# Altium project Gimbal_Rev2.PrjPcb (part 1 of 2)
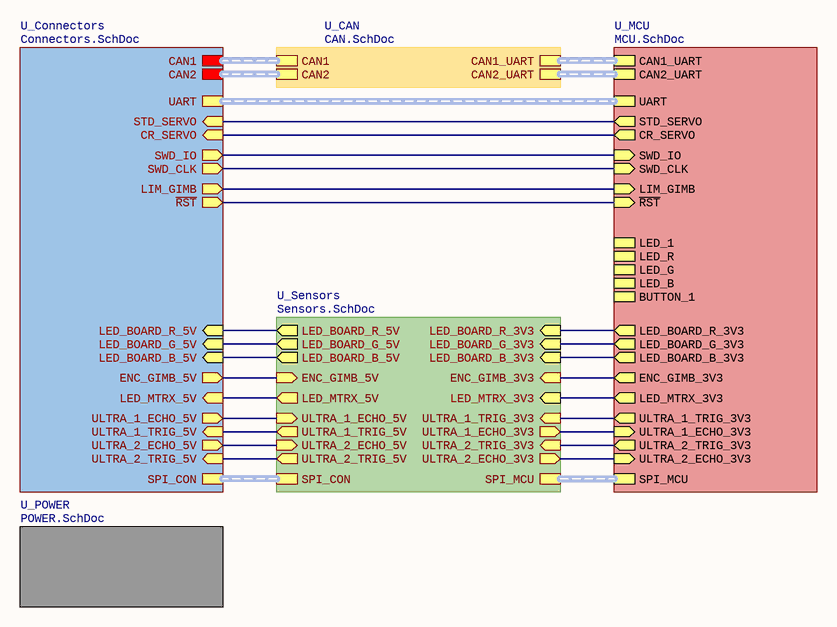
[diagram p0: Block Diagram.SchDoc]
6 sheets, 110 parts. Net scope: hierarchical (ports join the sheet entries above them; power ports are global).
Sheets:
  Block Diagram.SchDoc
    U_Connectors = Connectors.SchDoc
    U_MCU = MCU.SchDoc
    U_POWER = POWER.SchDoc
    U_Sensors = Sensors.SchDoc
    U_CAN = CAN.SchDoc

## Sheet Block Diagram.SchDoc: Gimbal - Block Diagram
size Letter; DrawnBy: Aidan Gratton; Organization: UW Robotics; Address1: 200 University Avenue; Address2: Waterloo; Address3: Ontario; Address4: Canada N2L 3G6; SheetNumber: 1

### Sub-sheets
U_CAN = CAN.SchDoc: CAN1 (harness CAN1), CAN2 (harness CAN2), CAN2_UART (harness CAN2_UART), CAN1_UART (harness CAN1_UART)
U_Connectors = Connectors.SchDoc: ~{RST} (out), LIM_GIMB (out), LED_MTRX_5V (in), CAN1 (harness CAN1), CAN2 (harness CAN2), UART (harness UART), SPI_CON (harness SPI_CON), ENC_GIMB_5V (out), ULTRA_1_ECHO_5V (out), ULTRA_1_TRIG_5V (in), ULTRA_2_ECHO_5V (out), ULTRA_2_TRIG_5V (in), STD_SERVO (in), CR_SERVO (in), SWD_IO (out), SWD_CLK (out), LED_BOARD_R_5V (in), LED_BOARD_G_5V (in), LED_BOARD_B_5V (in)
U_MCU = MCU.SchDoc: ~{RST} (in), ENC_GIMB_3V3 (out), LIM_GIMB (in), UART (harness UART), CAN1_UART (harness CAN1_UART), CAN2_UART (harness CAN2_UART), SPI_MCU (harness SPI), LED_MTRX_3V3 (out), ULTRA_1_TRIG_3V3 (out), ULTRA_1_ECHO_3V3 (in), ULTRA_2_TRIG_3V3 (out), ULTRA_2_ECHO_3V3 (in), LED_1, LED_R, LED_G, LED_B, BUTTON_1, STD_SERVO (out), CR_SERVO (out), SWD_IO (in), SWD_CLK (in), LED_BOARD_R_3V3 (out), LED_BOARD_G_3V3 (out), LED_BOARD_B_3V3 (out)
U_POWER = POWER.SchDoc: no entries
U_Sensors = Sensors.SchDoc: ENC_GIMB_3V3 (in), SPI_MCU (harness SPI), SPI_CON (harness SPI_CON), ENC_GIMB_5V (in), ULTRA_1_TRIG_3V3 (in), ULTRA_1_ECHO_3V3 (out), ULTRA_2_TRIG_3V3 (in), ULTRA_2_ECHO_3V3 (out), ULTRA_1_ECHO_5V (in), ULTRA_1_TRIG_5V (out), ULTRA_2_ECHO_5V (in), ULTRA_2_TRIG_5V (out), LED_MTRX_5V (out), LED_MTRX_3V3 (in), LED_BOARD_R_3V3 (in), LED_BOARD_G_3V3 (in), LED_BOARD_B_3V3 (in), LED_BOARD_B_5V (out), LED_BOARD_G_5V (out), LED_BOARD_R_5V (out)

### Nets
NetCR_SERVO_1: sheet U_Connectors/CR_SERVO, sheet U_MCU/CR_SERVO
NetECHO1_1: sheet U_MCU/ULTRA_1_ECHO_3V3, sheet U_Sensors/ULTRA_1_ECHO_3V3
NetECHO2_1: sheet U_MCU/ULTRA_2_ECHO_3V3, sheet U_Sensors/ULTRA_2_ECHO_3V3
NetENC1_1: sheet U_MCU/ENC_GIMB_3V3, sheet U_Sensors/ENC_GIMB_3V3
NetJ1_6: sheet U_Connectors/SWD_IO, sheet U_MCU/SWD_IO
NetJ1_7: sheet U_Connectors/SWD_CLK, sheet U_MCU/SWD_CLK
NetJ1_8: sheet U_Connectors/~{RST}, sheet U_MCU/~{RST}
NetJ3_1: sheet U_Connectors/STD_SERVO, sheet U_MCU/STD_SERVO
NetJ4_3: sheet U_Connectors/ULTRA_1_ECHO_5V, sheet U_Sensors/ULTRA_1_ECHO_5V
NetJ4_5: sheet U_Connectors/LED_MTRX_5V, sheet U_Connectors/ULTRA_1_TRIG_5V, sheet U_Connectors/ULTRA_2_TRIG_5V, sheet U_Sensors/ULTRA_1_TRIG_5V, sheet U_Sensors/ULTRA_2_TRIG_5V, sheet U_Sensors/LED_MTRX_5V
NetJ4_9: sheet U_Connectors/ULTRA_2_ECHO_5V, sheet U_Sensors/ULTRA_2_ECHO_5V
NetJ4_10: sheet U_Connectors/LIM_GIMB, sheet U_MCU/LIM_GIMB
NetJ4_23: sheet U_Connectors/ENC_GIMB_5V, sheet U_Sensors/ENC_GIMB_5V
NetLED_BOARD_B_1: sheet U_Connectors/LED_BOARD_B_5V, sheet U_Sensors/LED_BOARD_B_5V
NetLED_BOARD_G_1: sheet U_Connectors/LED_BOARD_G_5V, sheet U_Sensors/LED_BOARD_G_5V
NetLED_BOARD_R_1: sheet U_Connectors/LED_BOARD_R_5V, sheet U_Sensors/LED_BOARD_R_5V
NetU3_2: sheet U_MCU/ULTRA_1_TRIG_3V3, sheet U_Sensors/ULTRA_1_TRIG_3V3
NetU3_3: sheet U_MCU/ULTRA_2_TRIG_3V3, sheet U_Sensors/ULTRA_2_TRIG_3V3
NetU3_4: sheet U_MCU/LED_MTRX_3V3, sheet U_Sensors/LED_MTRX_3V3
NetU5_2: sheet U_MCU/LED_BOARD_R_3V3, sheet U_Sensors/LED_BOARD_R_3V3
NetU5_3: sheet U_MCU/LED_BOARD_G_3V3, sheet U_Sensors/LED_BOARD_G_3V3
NetU5_4: sheet U_MCU/LED_BOARD_B_3V3, sheet U_Sensors/LED_BOARD_B_3V3

### Buses and harness runs
harness sheet U_CAN/CAN1 = sheet U_Connectors/CAN1
harness sheet U_CAN/CAN1_UART = sheet U_MCU/CAN1_UART
harness sheet U_CAN/CAN2 = sheet U_Connectors/CAN2
harness sheet U_CAN/CAN2_UART = sheet U_MCU/CAN2_UART
harness sheet U_Connectors/SPI_CON = sheet U_Sensors/SPI_CON
harness sheet U_Connectors/UART = sheet U_MCU/UART
harness sheet U_MCU/SPI_MCU = sheet U_Sensors/SPI_MCU

### Notes on the sheet
- Title
- Size:
- Date:
- Letter
- Drawn By:
- Sheet
- of
- File:

## Sheet Connectors.SchDoc: Gimbal - Connectors
size Letter; DrawnBy: Aidan Gratton; Organization: UW Robotics; Address1: 200 University Avenue; Address2: Waterloo; Address3: Ontario; Address4: Canada N2L 3G6; SheetNumber: 3; SheetTotal: 7
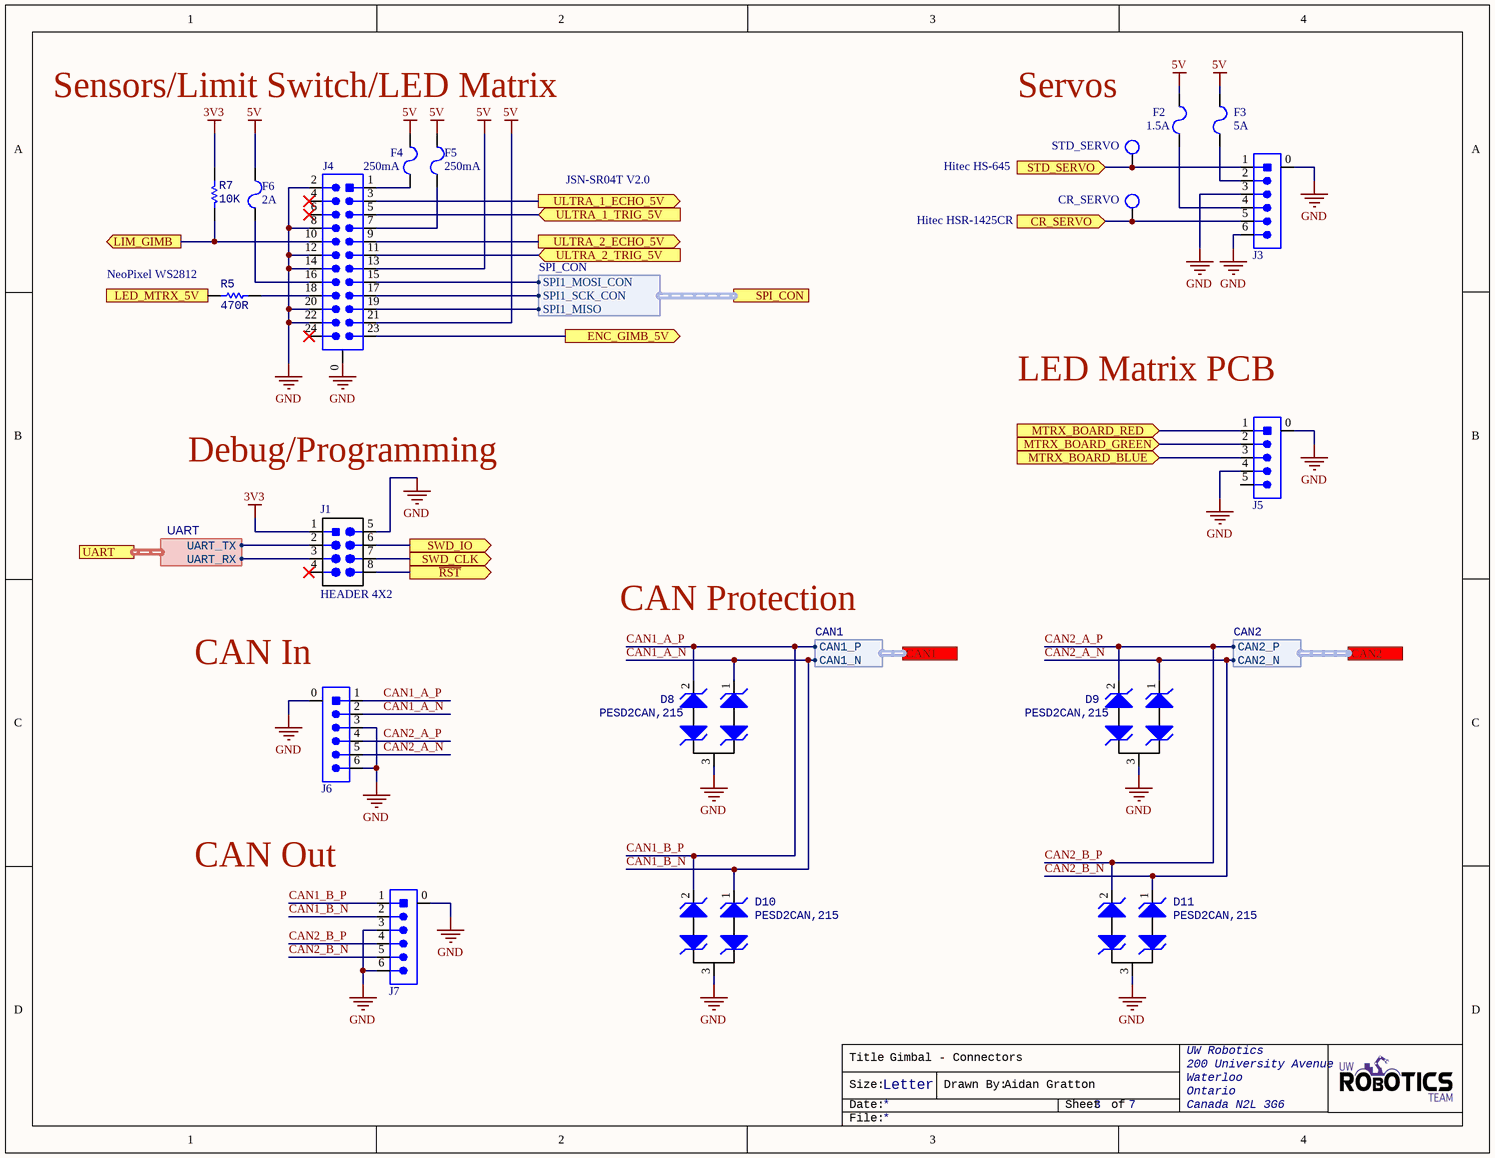
[diagram p1: Connectors.SchDoc]

### Parts
CR_SERVO  TESTPOINT_LOOP  [TESTPOINT_LOOP]  (value not drawn)
D8  Manufacturer Part Number: PESD2CAN,215  [TVS_DIODE_CAN]  (hidden comment: TVS_DIODE_CAN)
D9  Manufacturer Part Number: PESD2CAN,215  [TVS_DIODE_CAN]  (hidden comment: TVS_DIODE_CAN)
D10  Manufacturer Part Number: PESD2CAN,215  [TVS_DIODE_CAN]  (hidden comment: TVS_DIODE_CAN)
D11  Manufacturer Part Number: PESD2CAN,215  [TVS_DIODE_CAN]  (hidden comment: TVS_DIODE_CAN)
F2  Current Rating: 1.5A  [FUSE_1206]  (hidden comment: FUSE_1.5A_1206)
F3  Current Rating: 5A  [FUSE_1206]  (hidden comment: FUSE_5A_1206)
F4  Current Rating: 250mA  [FUSE_1206]  (hidden comment: FUSE_250mA_1206)
F5  Current Rating: 250mA  [FUSE_1206]  (hidden comment: FUSE_250mA_1206)
F6  Current Rating: 2A  [FUSE_1206]  (hidden comment: FUSE_2A_1206)
J1  HEADER 4X2  [HEADER_2X4]
J3  CON_6M_SM_RA  [MOLEX-5024940670]  (value not drawn)
J4  CON_12x2M_SM_RA  [MOLEX-5031482490]  (value not drawn)
J5  CON_5M_SM_RA  [MOLEX-5025850570]  (value not drawn)
J6  CON_6M_SM_RA  [MOLEX-5024940670]  (value not drawn)
J7  CON_6M_SM_RA  [MOLEX-5024940670]  (value not drawn)
R5  value 470R  [RESC0603(1608)_N]  (hidden comment: 470R 1%)
R7  value 10K  [RESC0603(1608)_N]  (hidden comment: RES_10K_0603)
STD_SERVO  TESTPOINT_LOOP  [TESTPOINT_LOOP]  (value not drawn)

### Ports
CAN1 (harness CAN1), CAN2 (harness CAN2), CR_SERVO (in), ENC_GIMB_5V (out), LED_MTRX_5V (in), LIM_GIMB (out), MTRX_BOARD_BLUE (in), MTRX_BOARD_GREEN (in), MTRX_BOARD_RED (in), SPI_CON (harness SPI_CON), STD_SERVO (in), SWD_CLK (out), SWD_IO (out), UART (harness UART), ULTRA_1_ECHO_5V (out), ULTRA_1_TRIG_5V (in), ULTRA_2_ECHO_5V (out), ULTRA_2_TRIG_5V (in), ~{RST} (out)

### Harnesses
UART: UART_RX, UART_TX
CAN2: CAN2_P, CAN2_N
CAN1: CAN1_P, CAN1_N
SPI_CON: SPI1_MISO, SPI1_MOSI_CON, SPI1_SCK_CON

### Nets
3V3: J1.1(VCC) R7.2
5V: F2.2 F3.2 F4.1 F5.2 F6.2 J4.13 J4.21
GND: D8.3 D9.3 D10.3 D11.3 J1.5(GND) J3.0 J3.3 J3.6 J4.0 J4.2 J4.8 J4.12 J4.14 J4.20 J4.22 J5.0 J5.4 J6.0 J6.3 J6.6 J7.0 J7.3 J7.6
CAN1_A_N: D8.1 D10.1 J6.2 J7.2 ; port CAN1.CAN1_N  [also labelled CAN1_B_N]
CAN1_A_P: D8.2 D10.2 J6.1 J7.1 ; port CAN1.CAN1_P  [also labelled CAN1_B_P]
CAN2_A_N: D9.1 D11.1 J6.5 J7.5 ; port CAN2.CAN2_N  [also labelled CAN2_B_N]
CAN2_A_P: D9.2 D11.2 J6.4 J7.4 ; port CAN2.CAN2_P  [also labelled CAN2_B_P]
NetCR_SERVO_1: CR_SERVO.1 J3.5 ; port CR_SERVO
NetF2_1: F2.1 J3.4
NetF3_1: F3.1 J3.2
NetF4_2: F4.2 J4.1
NetF5_1: F5.1 J4.7
NetF6_1: F6.1 J4.16
NetJ1_2: J1.2 ; port UART.UART_TX
NetJ1_3: J1.3 ; port UART.UART_RX
NetJ1_6: J1.6 ; port SWD_IO
NetJ1_7: J1.7 ; port SWD_CLK
NetJ1_8: J1.8 ; port ~{RST}
NetJ3_1: J3.1 STD_SERVO.1 ; port STD_SERVO
NetJ4_3: J4.3 ; port ULTRA_1_ECHO_5V
NetJ4_5: J4.5 J4.11 R5.1 ; port LED_MTRX_5V, port ULTRA_1_TRIG_5V, port ULTRA_2_TRIG_5V
NetJ4_9: J4.9 ; port ULTRA_2_ECHO_5V
NetJ4_10: J4.10 R7.1 ; port LIM_GIMB
NetJ4_15: J4.15 ; port SPI_CON.SPI1_MOSI_CON
NetJ4_17: J4.17 ; port SPI_CON.SPI1_SCK_CON
NetJ4_18: J4.18 R5.2
NetJ4_19: J4.19 ; port SPI_CON.SPI1_MISO
NetJ4_23: J4.23 ; port ENC_GIMB_5V
NetJ5_1: J5.1 ; port MTRX_BOARD_RED
NetJ5_2: J5.2 ; port MTRX_BOARD_GREEN
NetJ5_3: J5.3 ; port MTRX_BOARD_BLUE

Not connected (* = marked no-connect by the designer): J1 4*; J4 4* 6* 24*; J5 5

### Notes on the sheet
- Sensors/Limit Switch/LED Matrix
- Servos
- JSN-SR04T V2.0
- Hitec HSR-1425CR
- Hitec HS-645
- (near R5) NeoPixel WS2812
- (near J5) LED Matrix PCB
- Debug/Programming
- CAN Protection
- (near J6) CAN In
- CAN Out
- Title
- Size:
- Date:
- Letter
- Drawn By:
- Sheet
- of
- File:

### Library data of the parts
CR_SERVO STD_SERVO = TESTPOINT_LOOP: Loop testpoint through-hole pad; Manufacturer: Keystone Electronics; Manufacturer Part Number 1: 5002; Supplier Part Number 1: 36-5002-ND; Supplier 1: Digi-Key
D8-D11 = TVS_DIODE_CAN: TVS DIODE 24V 41V SOT323-3; Manufacturer: Nexperia USA Inc.; Package: SC-70, SOT-323; ComponentLink1Description: Datasheet; ComponentLink1URL: https://assets.nexperia.com/documents/data-sheet/PESD1CAN-U.pdf; Supplier Part Number 1: 1727-3891-1-ND; Supplier 1: Digi-Key
F2 = FUSE_1.5A_1206: FUSE SMD 1.5A 63V; Manufacturer 1: Littelfuse; Manufacturer Part Number 1: 046601.5NR; Fuse Type: Board Mount (Cartridge Style Excluded); DC Cold Resistance: 31mR; Power Dissipation: 157.5mW; Approvals: UL,CSA; Supplier 1: Digi-Key; Stock 1: 8989; Pricing 1: 1=0.84000, 5=0.81200, 10=0.78700, 50=0.66180, 100=0.54930, 250=0.49940, 500=0.42450, 1000=0.37455 (USD); RoHS: Yes; Mount: Surface Mount; Case/Package: 1206; Case Code (Imperial): 1206; Case Code (Metric): 3216; Housing Material: Ceramic; Min Operating Temperature: -55°C; Max Operating Temperature: 90°C; Package Quantity: 5000; Voltage Rating (AC): 63V; Voltage Rating (DC): 63V; Packaging: Tape and Reel; Current: 1.5A; Length: 3.18mm; Height: 0.023inch; Width: 0.06inch; Depth: 1.52mm; ComponentLink1URL: https://datasheet.ciiva.com/7444/littelfuse-fuse-466-7444359.pdf?src-supplier=Digi-Key; ComponentLink1Description: https://datasheet.ciiva.com/7444/littelfuse-fuse-466-7444359.pdf?src-supplier=Digi-Key; ComponentLink2URL: https://datasheet.ciiva.com/7444/littelfuse-fuse-466-7444363.pdf?src-supplier=Digi-Key; ComponentLink2Description: https://datasheet.ciiva.com/7444/littelfuse-fuse-466-7444363.pdf?src-supplier=Digi-Key; ComponentLink3URL: https://datasheet.ciiva.com/7444/littelfuse-fuse-466-7444350.pdf?src-supplier=Digi-Key; ComponentLink3Description: https://datasheet.ciiva.com/7444/littelfuse-fuse-466-7444350.pdf?src-supplier=Digi-Key; Supplier Part Number 1: F1462CT-ND
F3 = FUSE_5A_1206: FUSE SMD 5A 63V; Manufacturer 1: Littelfuse; Manufacturer Part Number 1: 0466005.NRHF; Voltage Rating (AC): 32V; Fuse Type: Board Mount (Cartridge Style Excluded); DC Cold Resistance: 31mR; Power Dissipation: 157.5mW; Approvals: UL,CSA; Supplier 1: Digi-Key; Stock 1: 8989; Pricing 1: 1=0.84000, 5=0.81200, 10=0.78700, 50=0.66180, 100=0.54930, 250=0.49940, 500=0.42450, 1000=0.37455 (USD); RoHS: Yes; Mount: Surface Mount; Case/Package: 1206; Case Code (Imperial): 1206; Case Code (Metric): 3216; Housing Material: Ceramic; Min Operating Temperature: -55°C; Max Operating Temperature: 90°C; Package Quantity: 5000; Voltage Rating (DC): 32V; Packaging: Tape and Reel; Current: 5A; Length: 3.18mm; Height: 0.023inch; Width: 0.06inch; Depth: 1.52mm; ComponentLink1URL: https://datasheet.ciiva.com/7444/littelfuse-fuse-466-7444359.pdf?src-supplier=Digi-Key; ComponentLink1Description: https://datasheet.ciiva.com/7444/littelfuse-fuse-466-7444359.pdf?src-supplier=Digi-Key; ComponentLink2URL: https://datasheet.ciiva.com/7444/littelfuse-fuse-466-7444363.pdf?src-supplier=Digi-Key; ComponentLink2Description: https://datasheet.ciiva.com/7444/littelfuse-fuse-466-7444363.pdf?src-supplier=Digi-Key; ComponentLink3URL: https://datasheet.ciiva.com/7444/littelfuse-fuse-466-7444350.pdf?src-supplier=Digi-Key; ComponentLink3Description: https://datasheet.ciiva.com/7444/littelfuse-fuse-466-7444350.pdf?src-supplier=Digi-Key; Supplier Part Number 1: F6019CT-ND
F4 F5 = FUSE_250mA_1206: FUSE SMD 250mA 125V; Manufacturer 1: Littelfuse; Manufacturer Part Number 1: 0466.250NR; Fuse Type: Board Mount (Cartridge Style Excluded); DC Cold Resistance: 31mR; Power Dissipation: 157.5mW; Approvals: UL,CSA; Supplier 1: Digi-Key; Stock 1: 8989; Pricing 1: 1=0.84000, 5=0.81200, 10=0.78700, 50=0.66180, 100=0.54930, 250=0.49940, 500=0.42450, 1000=0.37455 (USD); RoHS: Yes; Mount: Surface Mount; Case/Package: 1206; Case Code (Imperial): 1206; Case Code (Metric): 3216; Housing Material: Ceramic; Min Operating Temperature: -55°C; Max Operating Temperature: 90°C; Package Quantity: 5000; Voltage Rating (AC): 125V; Voltage Rating (DC): 125V; Packaging: Tape and Reel; Current: 250mA; Length: 3.18mm; Height: 0.023inch; Width: 0.06inch; Depth: 1.52mm; ComponentLink1URL: https://datasheet.ciiva.com/7444/littelfuse-fuse-466-7444359.pdf?src-supplier=Digi-Key; ComponentLink1Description: https://datasheet.ciiva.com/7444/littelfuse-fuse-466-7444359.pdf?src-supplier=Digi-Key; ComponentLink2URL: https://datasheet.ciiva.com/7444/littelfuse-fuse-466-7444363.pdf?src-supplier=Digi-Key; ComponentLink2Description: https://datasheet.ciiva.com/7444/littelfuse-fuse-466-7444363.pdf?src-supplier=Digi-Key; ComponentLink3URL: https://datasheet.ciiva.com/7444/littelfuse-fuse-466-7444350.pdf?src-supplier=Digi-Key; ComponentLink3Description: https://datasheet.ciiva.com/7444/littelfuse-fuse-466-7444350.pdf?src-supplier=Digi-Key; Supplier Part Number 1: F1452CT-ND
F6 = FUSE_2A_1206: FUSE SMD 2A 63V; Manufacturer 1: Littelfuse; Manufacturer Part Number 1: 0466002.NRHF; Fuse Type: Board Mount (Cartridge Style Excluded); DC Cold Resistance: 31mR; Power Dissipation: 157.5mW; Approvals: UL,CSA; Supplier 1: Digi-Key; Stock 1: 8989; Pricing 1: 1=0.84000, 5=0.81200, 10=0.78700, 50=0.66180, 100=0.54930, 250=0.49940, 500=0.42450, 1000=0.37455 (USD); RoHS: Yes; Mount: Surface Mount; Case/Package: 1206; Case Code (Imperial): 1206; Case Code (Metric): 3216; Housing Material: Ceramic; Min Operating Temperature: -55°C; Max Operating Temperature: 90°C; Package Quantity: 5000; Voltage Rating (AC): 63V; Voltage Rating (DC): 63V; Packaging: Tape and Reel; Current: 2A; Length: 3.18mm; Height: 0.023inch; Width: 0.06inch; Depth: 1.52mm; ComponentLink1URL: https://datasheet.ciiva.com/7444/littelfuse-fuse-466-7444359.pdf?src-supplier=Digi-Key; ComponentLink1Description: https://datasheet.ciiva.com/7444/littelfuse-fuse-466-7444359.pdf?src-supplier=Digi-Key; ComponentLink2URL: https://datasheet.ciiva.com/7444/littelfuse-fuse-466-7444363.pdf?src-supplier=Digi-Key; ComponentLink2Description: https://datasheet.ciiva.com/7444/littelfuse-fuse-466-7444363.pdf?src-supplier=Digi-Key; ComponentLink3URL: https://datasheet.ciiva.com/7444/littelfuse-fuse-466-7444350.pdf?src-supplier=Digi-Key; ComponentLink3Description: https://datasheet.ciiva.com/7444/littelfuse-fuse-466-7444350.pdf?src-supplier=Digi-Key; Supplier Part Number 1: F5696CT-ND
J1 = HEADER 4X2: CONN HEADER VERT 8POS 2.54MM; Manufacturer Part Number 1: M20-9980445; Manufacturer 1: Harwin Inc.; Supplier Part Number 1: 952-2122-ND; Supplier 1: Digi-Key; Mount: Through Hole
J3 J6 J7 = CON_6M_SM_RA: CONN HEADER SMD RIGHT ANGLE 2MM PITCH; Manufacturer 1: Molex; Manufacturer Part Number 1: 502494-0670; Insulation Resistance: 1GR; Current Rating: 3A; Voltage Rating: 250V; Connector Type: Receptacle,Forked; Number of Positions: 6; Gender: Receptacle; Glow Wire Compliant: Non-compliant; Supplier 1: Digi-Key; Stock 1: 7093; Pricing 1: 1=0.81000, 10=0.70800, 25=0.66680, 50=0.63880, 100=0.61110, 250=0.55552 (USD); RoHS: Yes; Mount: Surface Mount; Material: Polybutylene; Color: Natural; Housing Material: PBT; Housing Color: Natural; Contact Plating: Tin; Contact Material: Copper Alloy; Min Operating Temperature: -25°C; Max Operating Temperature: 85°C; Package Quantity: 950; Number of Rows: 1; Fastening Type: Latch; Packaging: Tape and Reel; Termination: Solder; Number of Contacts: 6; Orientation: Right Angle; Number of Circuits: 6; Contact Gender: Female; Max Voltage Rating (AC): 250V; Max Voltage Rating (DC): 250V; Length: 16mm; Pitch: 2mm; Depth: 6.85mm; Radiation Hardening: No; REACH SVHC: Unknown; Flammability Rating: UL94 V-0; ComponentLink1URL: https://datasheet.ciiva.com/755/5024940670-sd-755844.pdf?src-supplier=Digi-Key; ComponentLink1Description: https://datasheet.ciiva.com/755/5024940670-sd-755844.pdf?src-supplier=Digi-Key; ComponentLink2URL: https://datasheet.ciiva.com/24467/101355024940670-pcb-receptacles-24467588.pdf?src-supplier=Onlinecomponents.com; ComponentLink2Description: https://datasheet.ciiva.com/24467/101355024940670-pcb-receptacles-24467588.pdf?src-supplier=Onlinecomponents.com; ComponentLink3URL: https://datasheet.ciiva.com/16656/5024940670-pcb-receptacles-16656439.pdf?src-supplier=Avnet+Europe; ComponentLink3Description: https://datasheet.ciiva.com/16656/5024940670-pcb-receptacles-16656439.pdf?src-supplier=Avnet+Europe; ComponentLink4URL: https://datasheet.ciiva.com/7436/1630854-7436283.pdf?src-supplier=Newark; ComponentLink4Description: https://datasheet.ciiva.com/7436/1630854-7436283.pdf?src-supplier=Newark; ComponentLink5URL: https://datasheet.ciiva.com/5157/5024940670-pcb-receptacles-179322-5157180.pdf?src-supplier=Mouser; ComponentLink5Description: https://datasheet.ciiva.com/5157/5024940670-pcb-receptacles-179322-5157180.pdf?src-supplier=Mouser; ComponentLink6URL: https://datasheet.ciiva.com/7917/1630854-7917014.pdf?src-supplier=Element14; ComponentLink6Description: https://datasheet.ciiva.com/7917/1630854-7917014.pdf?src-supplier=Element14; ComponentLink7URL: https://datasheet.ciiva.com/30242/101355024940670-pcb-receptacles-30242550.pdf?src-supplier=Onlinecomponents.com; ComponentLink7Description: https://datasheet.ciiva.com/30242/101355024940670-pcb-receptacles-30242550.pdf?src-supplier=Onlinecomponents.com; ComponentLink8URL: https://datasheet.ciiva.com/755/5024940670-sd-755789.pdf?src-supplier=Digi-Key; ComponentLink8Description: https://datasheet.ciiva.com/755/5024940670-sd-755789.pdf?src-supplier=Digi-Key; Supplier Part Number 1: WM2283CT-ND
J4 = CON_12x2M_SM_RA: CONN HEADER SMD RIGHT ANGLE 1.5MM PITCH
J5 = CON_5M_SM_RA: CONN HEADER SMD RIGHT ANGLE 1.5MM PITCH; Manufacturer 1: Molex; Manufacturer Part Number 1: 5025850570; Connector Type: Receptacle,Center Strip Contact; Number of Positions: 5; Current Rating: 2A; Supplier 1: Digi-Key; Stock 1: 2875; RoHS: Yes; Mount: Surface Mount; Termination: Solder; Number of Contacts: 5; Orientation: Right Angle; Number of Circuits: 5; Number of Rows: 1; Supplier Part Number 1: WM14469CT-ND
R5 = RES_470R_0603: RES SMD 470 OHM 1% 1/10W 0603; Manufacturer: Yageo; MPN: AC0603FR-07470RL; Package: 0603 (1608 Metric); Dimensions: 0.063" L x 0.031" W (1.60mm x 0.80mm); Tolerance: 1%; Supplier Part Number 1: 311-470LDCT-ND; Supplier 1: Digi-Key
R7 = RES_10K_0603: RES SMD 10K OHM 5% 1/10W 0603; Manufacturer: Yageo; MPN: RC0603JR-0710KL; Package: 0603 (1608 Metric); Dimensions: 0.063" L x 0.031" W (1.60mm x 0.80mm); Tolerance: 5%; Supplier Part Number 1: 311-10KGRCT-ND; Supplier 1: Digi-Key

## Sheet MCU.SchDoc: Gimbal - Microcontroller
size Letter; DrawnBy: Aidan Gratton; Organization: UW Robotics; Address1: 200 University Avenue; Address2: Waterloo; Address3: Ontario; Address4: Canada N2L 3G6; SheetNumber: 4; SheetTotal: 7
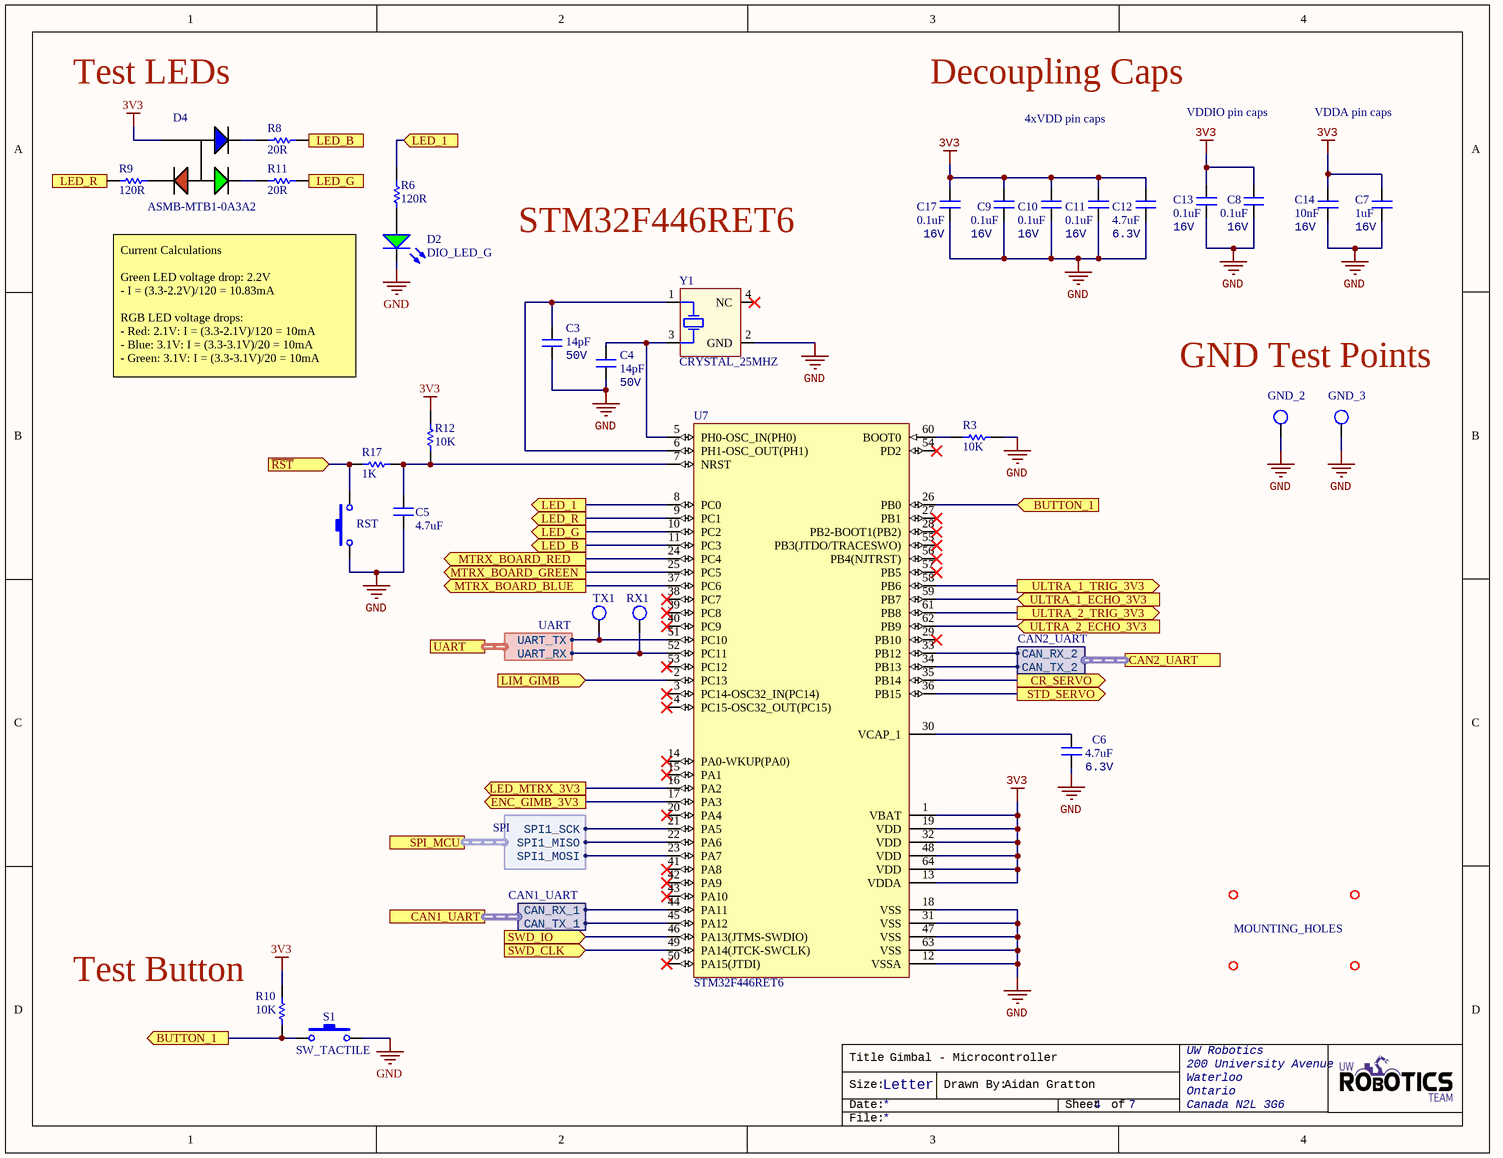
[diagram p2: MCU.SchDoc]

### Parts
C3  value 14pF  Voltage Rating (DC): 50V  [CAPC0603(1608)55_N]  (hidden comment: CL10C140JB8NNNC)
C4  value 14pF  Voltage Rating (DC): 50V  [CAPC0603(1608)55_N]  (hidden comment: CL10C140JB8NNNC)
C5  value 4.7uF  [CAPC0603(1608)55_N]  (hidden comment: CAP_4.7uF_0603)
C6  value 4.7uF  Voltage Rating: 6.3V  [CAPC0603(1608)55_N]  (hidden comment: CAP_4.7uF_0603)
C7  value 1uF  Voltage Rating: 16V  [CAPC0603(1608)55_N]  (hidden comment: CAP_1uF_16V_0603)
C8  value 0.1uF  Voltage Rating: 16V  [CAPC0603(1608)55_N]  (hidden comment: CAP_0.1uF_16V_0603)
C9  value 0.1uF  Voltage Rating: 16V  [CAPC0603(1608)55_N]  (hidden comment: CAP_0.1uF_16V_0603)
C10  value 0.1uF  Voltage Rating: 16V  [CAPC0603(1608)55_N]  (hidden comment: CAP_0.1uF_16V_0603)
C11  value 0.1uF  Voltage Rating: 16V  [CAPC0603(1608)55_N]  (hidden comment: CAP_0.1uF_16V_0603)
C12  value 4.7uF  Voltage Rating: 6.3V  [CAPC0603(1608)55_N]  (hidden comment: CAP_4.7uF_0603)
C13  value 0.1uF  Voltage Rating: 16V  [CAPC0603(1608)55_N]  (hidden comment: CAP_0.1uF_16V_0603)
C14  value 10nF  Voltage Rating: 16V  [CAPC0603(1608)55_N]  (hidden comment: CAP_10nF_0603)
C17  value 0.1uF  Voltage Rating: 16V  [CAPC0603(1608)55_N]  (hidden comment: CAP_0.1uF_16V_0603)
D2  DIO_LED_G  [LED_0805_LINE]
D4  Manufacturer Part Number 1: ASMB-MTB1-0A3A2  [LED_RGB]  (hidden comment: LED_RGB)
GND_2  TESTPOINT_LOOP  [TESTPOINT_LOOP]  (value not drawn)
GND_3  TESTPOINT_LOOP  [TESTPOINT_LOOP]  (value not drawn)
MH1  MOUNTING_HOLES  [MOUNTING_HOLE]
MH2  MOUNTING_HOLES  [MOUNTING_HOLE]  (value not drawn)
MH3  MOUNTING_HOLES  [MOUNTING_HOLE]  (value not drawn)
MH4  MOUNTING_HOLES  [MOUNTING_HOLE]  (value not drawn)
R3  value 10K  [RESC0603(1608)_N]  (hidden comment: RES_10K_0603)
R6  value 120R  [RESC0603(1608)_N]  (hidden comment: RES_120R_0603)
R8  value 20R  [RESC0603(1608)_N]  (hidden comment: RES_20R_0603)
R9  value 120R  [RESC0603(1608)_N]  (hidden comment: RES_120R_0603)
R10  value 10K  [RESC0603(1608)_N]  (hidden comment: RES_10K_0603)
R11  value 20R  [RESC0603(1608)_N]  (hidden comment: RES_20R_0603)
R12  value 10K  [RESC0603(1608)_N]  (hidden comment: RES_10K_0603)
R17  value 1K  [RESC0603(1608)_N]  (hidden comment: RES_1K_0603)
RST  SW_PWR  [PTS830GM140]  (value not drawn)
RX1  TESTPOINT_LOOP  [TESTPOINT_LOOP]  (value not drawn)
S1  SW_TACTILE  [B3U-1100P]
TX1  TESTPOINT_LOOP  [TESTPOINT_LOOP]  (value not drawn)
U7  STM32F446RET6  [STM-LQFP64_L]
Y1  CRYSTAL_25MHZ  [AVX-CX2520DB32000D0GEJZ1-4_V]

### Ports
BUTTON_1 (in), BUTTON_1 (out), CAN1_UART (harness CAN1_UART), CAN2_UART (harness CAN2_UART), CR_SERVO (out), ENC_GIMB_3V3 (out), LED_1 (in), LED_1 (out), LED_B (in), LED_B (out), LED_G (in), LED_G (out), LED_MTRX_3V3 (out), LED_R (in), LED_R (out), LIM_GIMB (in), MTRX_BOARD_BLUE (out), MTRX_BOARD_GREEN (out), MTRX_BOARD_RED (out), SPI_MCU (harness SPI), STD_SERVO (out), SWD_CLK (in), SWD_IO (in), UART (harness UART), ULTRA_1_ECHO_3V3 (in), ULTRA_1_TRIG_3V3 (out), ULTRA_2_ECHO_3V3 (in), ULTRA_2_TRIG_3V3 (out), ~{RST} (in)

### Harnesses
UART: UART_RX, UART_TX
CAN1_UART: CAN_RX_1, CAN_TX_1
CAN2_UART: CAN_RX_2, CAN_TX_2
SPI: SPI1_SCK, SPI1_MISO, SPI1_MOSI

### Nets
3V3: C7.2 C8.2 C9.2 C10.2 C11.2 C12.2 C13.2 C14.2 C17.2 D4.4 R10.1 R12.2 U7.1(VBAT) U7.13(VDDA) U7.19(VDD) U7.32(VDD) U7.48(VDD) U7.64(VDD)
GND: C3.1 C4.1 C5.1 C6.1 C7.1 C8.1 C9.1 C10.1 C11.1 C12.1 C13.1 C14.1 C17.1 D2.2(K) GND_2.1 GND_3.1 R3.2 RST.1 S1.2 U7.12(VSSA) U7.18(VSS) U7.31(VSS) U7.47(VSS) U7.63(VSS) Y1.2(GND)
NetC3_2: C3.2 U7.6(PH1-OSC_OUT(PH1)) Y1.1(HOT)
NetC4_2: C4.2 U7.5(PH0-OSC_IN(PH0)) Y1.3(HOT)
NetC5_2: C5.2 R12.1 R17.2 U7.7(NRST)
NetC6_2: C6.2 U7.30(VCAP_1)
NetCR_SERVO_1: U7.35(PB14) ; port CR_SERVO
NetD2_1: D2.1(A) R6.2
NetD4_1: D4.1 R9.2
NetD4_2: D4.2 R11.1
NetD4_3: D4.3 R8.1
NetECHO1_1: U7.59(PB7) ; port ULTRA_1_ECHO_3V3
NetECHO2_1: U7.62(PB9) ; port ULTRA_2_ECHO_3V3
NetENC1_1: U7.17(PA3) ; port ENC_GIMB_3V3
NetJ1_2: TX1.1 U7.51(PC10) ; port UART.UART_TX
NetJ1_3: RX1.1 U7.52(PC11) ; port UART.UART_RX
NetJ1_6: U7.46(PA13(JTMS-SWDIO)) ; port SWD_IO
NetJ1_7: U7.49(PA14(JTCK-SWCLK)) ; port SWD_CLK
NetJ1_8: R17.1 RST.2 ; port ~{RST}
NetJ3_1: U7.36(PB15) ; port STD_SERVO
NetJ4_10: U7.2(PC13) ; port LIM_GIMB
NetR3_1: R3.1 U7.60(BOOT0)
NetR6_1: R6.1 U7.8(PC0) ; port LED_1
NetR8_2: R8.2 U7.11(PC3) ; port LED_B
NetR9_1: R9.1 U7.9(PC1) ; port LED_R
NetR10_2: R10.2 S1.1 U7.26(PB0) ; port BUTTON_1
NetR11_2: R11.2 U7.10(PC2) ; port LED_G
NetSPI_MISO_1: U7.22(PA6) ; port SPI_MCU.SPI1_MISO
NetSPI_MOSI_1: U7.23(PA7) ; port SPI_MCU.SPI1_MOSI
NetSPI_SCK_1: U7.21(PA5) ; port SPI_MCU.SPI1_SCK
NetU1_1: U7.45(PA12) ; port CAN1_UART.CAN_TX_1
NetU1_4: U7.44(PA11) ; port CAN1_UART.CAN_RX_1
NetU2_1: U7.34(PB13) ; port CAN2_UART.CAN_TX_2
NetU2_4: U7.33(PB12) ; port CAN2_UART.CAN_RX_2
NetU3_2: U7.58(PB6) ; port ULTRA_1_TRIG_3V3
NetU3_3: U7.61(PB8) ; port ULTRA_2_TRIG_3V3
NetU3_4: U7.16(PA2) ; port LED_MTRX_3V3
NetU7_24: U7.24(PC4) ; port MTRX_BOARD_RED
NetU7_25: U7.25(PC5) ; port MTRX_BOARD_GREEN
NetU7_37: U7.37(PC6) ; port MTRX_BOARD_BLUE

Not connected (* = marked no-connect by the designer): U7 3(PC14-OSC32_IN(PC14))* 4(PC15-OSC32_OUT(PC15))* 14(PA0-WKUP(PA0))* 15(PA1)* 20(PA4)* 27(PB1)* 28(PB2-BOOT1(PB2))* 29(PB10)* 38(PC7)* 39(PC8)* 40(PC9)* 41(PA8)* 42(PA9)* 43(PA10)* 50(PA15(JTDI))* 53(PC12)* 54(PD2)* 55(PB3(JTDO/TRACESWO))* 56(PB4(NJTRST))* 57(PB5)*; Y1 4(NC)*

### Notes on the sheet
- Test LEDs
- Decoupling Caps
- 4xVDD pin caps
- VDDIO pin caps
- VDDA pin caps
- STM32F446RET6
- Current Calculations
  Green LED voltage drop: 2.2V
  - I = (3.3-2.2V)/120 = 10.83mA
  RGB LED voltage drops:
  - Red: 2.1V: I = (3.3-2.1V)/120 = 10mA
  - Blue: 3.1V: I = (3.3-3.1V)/20 = 10mA
  - Green: 3.1V: I = (3.3-3.1V)/20 = 10mA
- GND Test Points
- (near R10) Test Button
- Title
- Size:
- Date:
- Letter
- Drawn By:
- Sheet
- of
- File:

### Library data of the parts
C3 C4 = CL10C140JB8NNNC: Cap Ceramic 14pF 50V C0G 5% SMD 0603 125C Cardboard T/R; Manufacturer 1: Samsung; Voltage Rating: 50V; Supplier Part Number 1: 1276-2187-1-ND; Supplier 1: Digi-Key; Manufacturer Part Number 1: CL10C140JB8NNNC; Stock 1: 187088; Pricing 1: 1=0.10000, 10=0.06700, 100=0.02980, 500=0.02130, 1000=0.01673 (USD); RoHS: Yes; Mount: Surface Mount; Case/Package: 0603; Case Code (Metric): 1608; Case Code (Imperial): 0603; Min Operating Temperature: -55°C; Max Operating Temperature: 125°C; Tolerance: 5%; Package Quantity: 1; Packaging: Tape and Reel; Dielectric: C0G; Length: 1.6mm; Height: 0.8mm; Width: 0.031inch; Depth: 0.8mm; Thickness: 0.035inch; Radiation Hardening: No; ComponentLink1URL: https://datasheet.ciiva.com/25782/cl10c140jb8nnnc-25782947.pdf?src-supplier=Digi-Key; ComponentLink1Description: https://datasheet.ciiva.com/25782/cl10c140jb8nnnc-25782947.pdf?src-supplier=Digi-Key; Capacitance: 14pF
C5 = CAP_4.7uF_0603: CAP CER 4.7UF 6.3V X5R 0603; Manufacturer Part Number 1: CC0603KRX5R5BB475; Manufacturer 1: Yageo; Dimensions: 0.063" L x 0.031" W (1.60mm x 0.80mm); Package: 0603 (1608 Metric); Temperature Coefficient: X5R; Voltage Rating: 6.3V; Supplier Part Number 1: 311-1521-1-ND; Supplier 1: Digi-Key; Mount: Surface Mount
C6 C12 = CAP_4.7uF_0603: CAP CER 4.7UF 6.3V X5R 0603; Manufacturer: Yageo; MPN: CC0603KRX5R5BB475; Dimensions: 0.063" L x 0.031" W (1.60mm x 0.80mm); Package: 0603 (1608 Metric); Temperature Coefficient: X5R; Supplier Part Number 1: 311-1521-1-ND; Supplier 1: Digi-Key
C7 = CAP_1uF_16V_0603: CAP CER 1UF 16V Y5V 0603; Manufacturer: Yageo; MPN: CC0603ZRY5V7BB105; Dimensions: 0.063" L x 0.031" W (1.60mm x 0.80mm); Package: 0603 (1608 Metric); Temperature Coefficient: Y5V; Supplier Part Number 1: 311-1372-1-ND; Supplier 1: Digi-Key
C8-C11 C13 C17 = CAP_0.1uF_16V_0603: CAP CER 0.1UF 16V X7R 0603; Manufacturer: Yageo; MPN: CC0603KRX7R7BB104; Dimensions: 0.063" L x 0.031" W (1.60mm x 0.80mm); Package: 0603 (1608 Metric); Temperature Coefficient: X7R; Supplier Part Number 1: 311-1088-1-ND; Supplier 1: Digi-Key
C14 = CAP_10nF_0603: CAP CER 10000PF 16V X7R 0603; Manufacturer: Yageo; MPN: CC0603KRX7R7BB103; Dimensions: 0.063" L x 0.031" W (1.60mm x 0.80mm); Package: 0603 (1608 Metric); Temperature Coefficient: X7R; Supplier Part Number 1: 311-3369-1-ND; Supplier 1: Digi-Key
D2 = DIO_LED_G: LED GREEN DIFFUSED 0805 SMD; Manufacturer: OSRAM; MPN: LG R971-KN-1; Forward Voltage Drop: 2.2V; Package: 0805 (2012 Metric); Supplier Part Number 1: 475-1410-1-ND; Supplier 1: Digi-Key
D4 = LED_RGB: LED RGB DIFFUSED 4PLCC SMD; Manufacturer 1: Broadcom; Color: Blue,Green,Red; Lens Color: White; Viewing Angle: 115°; Lens Style: Round; Luminous Intensity: 350mcd; Dominant Wavelength: 470nm; Forward Voltage: 3.1V; Test Current: 20mA; Supplier 1: Digi-Key; Stock 1: 142531; Pricing 1: 1=0.60000, 10=0.47100, 100=0.30210, 500=0.25980, 1000=0.20059 (USD); RoHS: Yes; Mount: Surface Mount; Case/Package: PLCC; Number of Pins: 4; Packaging: Cut Tape; Lens Transparency: Diffused; Length: 3.2mm; Height: 1.9mm; Width: 2.8mm; REACH SVHC: No SVHC; ComponentLink1URL: http://www.farnell.com/datasheets/2111106.pdf?src-supplier=Farnell; ComponentLink1Description: http://www.farnell.com/datasheets/2111106.pdf?src-supplier=Farnell; ComponentLink2URL: https://docs.broadcom.com/docs/AV02-4194EN?src-supplier=Digi-Key; ComponentLink2Description: https://docs.broadcom.com/docs/AV02-4194EN?src-supplier=Digi-Key; ComponentLink3URL: http://www.farnell.com/datasheets/1801564.pdf?src-supplier=Element14; ComponentLink3Description: http://www.farnell.com/datasheets/1801564.pdf?src-supplier=Element14; ComponentLink4URL: http://www.farnell.com/datasheets/2111106.pdf?src-supplier=Newark; ComponentLink4Description: http://www.farnell.com/datasheets/2111106.pdf?src-supplier=Newark; Supplier Part Number 1: 516-3280-1-ND
GND_2 GND_3 RX1 TX1 = TESTPOINT_LOOP: as CR_SERVO on sheet Connectors; Supplier Part Number 1: 36-5002-ND; Supplier 1: Digi-Key
MH1-MH4 = MOUNTING_HOLES: 6cm x 6cm
R3 R10 R12 = RES_10K_0603: as R7 on sheet Connectors; Package: 0603 (1608 Metric); Dimensions: 0.063" L x 0.031" W (1.60mm x 0.80mm); Tolerance: 5%; Supplier Part Number 1: 311-10KGRCT-ND; Supplier 1: Digi-Key
R6 R9 = RES_120R_0603: RES SMD 120 OHM 5% 1/10W 0603; Manufacturer: Yageo; MPN: RC0603JR-07120RL; Package: 0603 (1608 Metric); Dimensions: 0.063" L x 0.031" W (1.60mm x 0.80mm); Tolerance: 5%; Supplier Part Number 1: 311-120GRCT-ND; Supplier 1: Digi-Key
R8 R11 = RES_20R_0603: RES SMD 20 OHM 5% 1/10W 0603; Manufacturer: Yageo; MPN: RC0603JR-0720RL; Package: 0603 (1608 Metric); Dimensions: 0.063" L x 0.031" W (1.60mm x 0.80mm); Tolerance: 5%; Supplier Part Number 1: 311-20GRCT-ND; Supplier 1: Digi-Key
R17 = RES_1K_0603: RES SMD 1K OHM 5% 1/10W 0603; Manufacturer 1: Yageo; Manufacturer Part Number 1: RC0603JR-071KL; Dimensions: 0.063" L x 0.031" W (1.60mm x 0.80mm); Tolerance: 5%; Package: 0603 (1608 Metric); Supplier Part Number 1: 311-1.0KGRCT-ND; Supplier 1: Digi-Key; Mount: Surface Mount
RST = SW_PWR: Power Switch (Red); pin to pad: 2>4; MPN: PTS830GM140 SMTR LFS; Manufacturer: C&K; ComponentLink1Description: Datasheet; ComponentLink1URL: https://www.ckswitches.com/media/1478/pts830.pdf; Supplier Part Number 1: CKN10587CT-ND; Supplier 1: Digi-Key
S1 = SW_TACTILE: Tactile Switch (Grey); Manufacturer: Omron Electronics Inc-EMC Div; MPN: B3U-1100P; Supplier Part Number 1: SW1021CT-ND; Supplier 1: Digi-Key
U7 = MCU_STM32F446RET6: ARM Cortex-M4 32-bit MCU+FPU, 512 KB Flash, 128 KB Internal RAM, 50 I/Os, 64-Pin LQFP, -40 to 85 degC, Tray; I/Os (High Current): 50; Supply Voltage(Vcc) min (V): 1.7; Operating Frequency(F) (Processor speed) (MHz): 180; D/A Converter: 2; Internal RAM Size (kB): 128; FLASH Size (Prog) (kB): 512; Core: ARM Cortex-M4; ComponentLink1Description: Manufacturer URL; Package Reference: 64-Pin Low-profile Quad Flat Package, Body 10 x 10 mm, Pitch 0.5 mm; ComponentLink2URL: http://www.st.com/st-web-ui/static/active/en/resource/technical/document/datasheet/DM00141306.pdf; Packing: Tray; DatasheetVersion: Rev. 6; ComponentLink1URL: http://www.st.com/; ComponentLink2Description: Datasheet; Package Description: LQFP64; Mounting Technology: Surface Mount; Supplier Part Number 1: 497-15376-ND; Supplier 1: Digi-Key
Y1 = CRYSTAL_25MHZ: CRYSTAL 25.0000MHZ 12PF SMD; Manufacturer 1: Kyocera AVX; Manufacturer Part Number 1: CX2520DB25000H0FLJC1; Frequency: 25MHz; ESR (Equivalent Series Resistance): 80R; Frequency Stability: 15ppm; Frequency Tolerance: 10ppm; ComponentLink1Description: https://media.digikey.com/pdf/Data%20Sheets/AVX%20PDFs/CX2520DB_USY1M-H1-16429-00_Spec.pdf?src-supplier=Digi-Key; ComponentLink1URL: https://media.digikey.com/pdf/Data%20Sheets/AVX%20PDFs/CX2520DB_USY1M-H1-16429-00_Spec.pdf?src-supplier=Digi-Key; Supplier 1: Digi-Key; Supplier Part Number 1: 1253-1724-1-ND; Stock 1: 11741; Pricing 1: 1=0.72000, 10=0.63300, 50=0.59120, 100=0.52250, 500=0.49500, 1000=0.41250 (USD); RoHS: Yes; Mount: Surface Mount; Case/Package: SMD/SMT; Min Operating Temperature: -30°C; Max Operating Temperature: 85°C; Packaging: Tape and Reel; Load Capacitance: 12pF; Length: 0.098inch; Height: 0.022inch; Width: 0.079inch; Ratings: AEC-Q200

## Sheet POWER.SchDoc: Gimbal - Power
size Letter; Author: Aidan Gratton; DrawnBy: Aidan Gratton; Organization: UW Robotics; Address1: 200 University Avenue; Address2: Waterloo; Address3: Ontario; Address4: Canada N2L 3G6; SheetNumber: 6; SheetTotal: 7
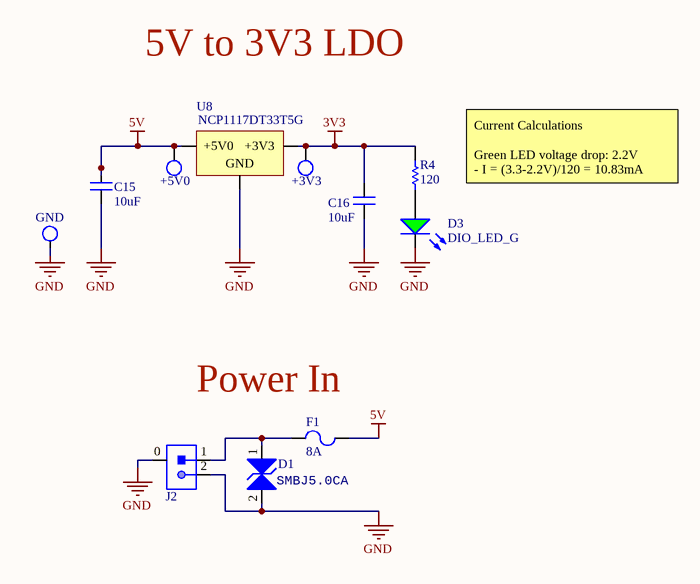
[diagram p3: POWER.SchDoc]

### Parts
+3V3  TESTPOINT_LOOP  [TESTPOINT_LOOP]  (value not drawn)
+5V0  TESTPOINT_LOOP  [TESTPOINT_LOOP]  (value not drawn)
C15  10uF  [CAPC1206(3216)]
C16  10uF  [CAPC1206(3216)]
D1  Manufacturer Part Number 1: SMBJ5.0CA  [TVS_DIODE_BIDIRECTIONAL]  (hidden comment: TVS_DIODE_BIDIRECTIONAL)
D3  DIO_LED_G  [LED_0805_LINE]
F1  Current Rating: 8A  [FUSE_1206]  (hidden comment: FUSE_8A_1206)
GND  TESTPOINT_LOOP  [TESTPOINT_LOOP]  (value not drawn)
J2  CON_2M_SM_RA  [MOLEX-5024940270]  (value not drawn)
R4  value 120  [RESC0603(1608)_N]  (hidden comment: RES_120R_0603)
U8  MPN: NCP1117DT33T5G  [VOLTAGE_REGULATOR]  (hidden comment: 5V0_3V3_LDO)

### Nets
3V3: +3V3.1 C16.2 R4.2 U8.2(+3V3)
5V: +5V0.1 C15.2 F1.2 U8.3(+5V0)
GND: C15.1 C16.1 D1.2 D3.2(K) GND.1 J2.0 J2.2 U8.1(GND)
NetD1_1: D1.1 F1.1 J2.1
NetD3_1: D3.1(A) R4.1

### Notes on the sheet
- 5V to 3V3 LDO
- Current Calculations
  Green LED voltage drop: 2.2V
  - I = (3.3-2.2V)/120 = 10.83mA
- Power In
- Title
- Size:
- Date:
- Letter
- Drawn By:
- Sheet
- of
- File:

### Library data of the parts
+3V3 +5V0 GND = TESTPOINT_LOOP: as CR_SERVO on sheet Connectors; Supplier Part Number 1: 36-5002-ND; Supplier 1: Digi-Key
C15 C16 = CAP_10uF_50V_1206: CAP CER 10UF 50V X5R 1206; MPN: GRT31CR61H106KE01L; Manufacturer: Murata; Dimensions: 0.126" L x 0.063" W (3.20mm x 1.6mm); Package: 1206 (3216 Metric); Supplier Part Number 1: 490-12456-1-ND; Supplier 1: Digi-Key; Value: 10uF; Voltage Rating: 50V
D1 = TVS_DIODE_BIDIRECTIONAL: TVS DIODE 5V 9.2V DO214AA; Manufacturer: Nexperia USA Inc.; Manufacturer 1: Littelfuse; Max Surge Current: 65.3A; Reverse Breakdown Voltage: 6.4V; Number of Elements: 1; Peak Pulse Power: 600W; Power Line Protection: No; Max Breakdown Voltage: 7V; Test Current: 10mA; ESD Protection: Yes; Max Reverse Leakage Current: 1.6mA; Max Power Dissipation: 5W; Element Configuration: Single; Package: SC-70, SOT-323; ComponentLink1Description: Datasheet; ComponentLink1URL: https://www.littelfuse.com/~/media/electronics/datasheets/tvs_diodes/littelfuse_tvs_diode_smbj_datasheet.pdf.pdf; Supplier Part Number 1: SMBJ5.0CALFCT-ND; Supplier 1: Digi-Key; Stock 1: 23233; Pricing 1: 1=0.39000, 10=0.31300, 25=0.28640, 100=0.17980, 250=0.17784, 500=0.16650, 1000=0.11322 (USD); Mount: Surface Mount; Case/Package: SMB; Number of Pins: 2; Min Operating Temperature: -65°C; Max Operating Temperature: 150°C; Direction: Bidirectional; Package Quantity: 3000; Packaging: Tape and Reel; Operating Supply Voltage: 5V; Number of Bidirectional Channels: 1; Reverse Standoff Voltage: 5V; Min Breakdown Voltage: 6.4V; Clamping Voltage: 9.2V; Breakdown Voltage: 6.4V; Number of Channels: 1; Polarity: Bidirectional; Power Dissipation: 600W; Peak Pulse Current: 65.3A; Leakage Current: 1.6mA; Voltage Rating (DC): 5V; Composition: Zener; Length: 0.179inch; Height: 0.096inch; Width: 0.155inch; Radiation Hardening: No; REACH SVHC: No SVHC; Lead Free: Lead Free
D3 = DIO_LED_G: LED GREEN DIFFUSED 0805 SMD; MPN: LG R971-KN-1; Manufacturer: OSRAM; Forward Voltage Drop: 2.2V; Package: 0805 (2012 Metric); Supplier Part Number 1: 475-1410-1-ND; Supplier 1: Digi-Key
F1 = FUSE_8A_1206: FUSE SMD 8A 24V; Manufacturer 1: Littelfuse; Manufacturer Part Number 1: 0469008.WR; Fuse Type: Board Mount (Cartridge Style Excluded); DC Cold Resistance: 31mR; Power Dissipation: 157.5mW; Approvals: UL,CSA; Supplier 1: Digi-Key; Stock 1: 8989; Pricing 1: 1=0.84000, 5=0.81200, 10=0.78700, 50=0.66180, 100=0.54930, 250=0.49940, 500=0.42450, 1000=0.37455 (USD); RoHS: Yes; Mount: Surface Mount; Case/Package: 1206; Case Code (Imperial): 1206; Case Code (Metric): 3216; Housing Material: Ceramic; Min Operating Temperature: -55°C; Max Operating Temperature: 90°C; Package Quantity: 5000; Voltage Rating (AC): 24V; Voltage Rating (DC): 24V; Packaging: Tape and Reel; Current: 8A; Length: 3.18mm; Height: 0.023inch; Width: 0.06inch; Depth: 1.52mm; ComponentLink1URL: https://datasheet.ciiva.com/7444/littelfuse-fuse-466-7444359.pdf?src-supplier=Digi-Key; ComponentLink1Description: https://datasheet.ciiva.com/7444/littelfuse-fuse-466-7444359.pdf?src-supplier=Digi-Key; ComponentLink2URL: https://datasheet.ciiva.com/7444/littelfuse-fuse-466-7444363.pdf?src-supplier=Digi-Key; ComponentLink2Description: https://datasheet.ciiva.com/7444/littelfuse-fuse-466-7444363.pdf?src-supplier=Digi-Key; ComponentLink3URL: https://datasheet.ciiva.com/7444/littelfuse-fuse-466-7444350.pdf?src-supplier=Digi-Key; ComponentLink3Description: https://datasheet.ciiva.com/7444/littelfuse-fuse-466-7444350.pdf?src-supplier=Digi-Key; Supplier Part Number 1: F3542CT-ND
J2 = CON_2M_SM_RA: CONN HEADER SMD RIGHT ANGLE 2MM PITCH; Manufacturer 1: Molex; Manufacturer Part Number 1: 5024940270; Connector Type: Receptacle,Forked; Number of Positions: 2; Supplier 1: Digi-Key; Stock 1: 3397; Pricing 1: 1=0.53000, 10=0.49400, 25=0.44440, 50=0.39500, 100=0.37850, 250=0.34556 (USD); RoHS: No; Mount: Surface Mount; Contact Plating: Tin; Insulation Color: Natural; Insulation Material: Resin; Min Operating Temperature: -40°C; Max Operating Temperature: 105°C; Fastening Type: Latch; Packaging: Tape and Reel; Number of Rows: 1; Termination: Solder; Flammability Rating: UL94 V-0; ComponentLink1URL: https://www.molex.com/pdm_docs/as/AS-502439-002-001.pdf?src-supplier=Digi-Key; ComponentLink1Description: https://www.molex.com/pdm_docs/as/AS-502439-002-001.pdf?src-supplier=Digi-Key; Supplier Part Number 1: WM15810CT-ND
R4 = RES_120R_0603: RES SMD 120 OHM 5% 1/10W 0603; Manufacturer 1: Yageo; Manufacturer Part Number 1: RC0603JR-07120RL; Package: 0603 (1608 Metric); Dimensions: 0.063" L x 0.031" W (1.60mm x 0.80mm); Tolerance: 5%; Supplier Part Number 1: 311-120GRCT-ND; Supplier 1: Digi-Key; Mount: Surface Mount
U8 = 5V0_3V3_LDO: IC REG LINEAR 3.3V 1A DPAK; Manufacturer: ON Semiconductor; Current Output: 1A; Supplier Part Number 1: NCP1117DT33T5GOSCT-ND; Supplier 1: Digi-Key

## Sheet Sensors.SchDoc: Gimbal - Sensors
size Letter; DrawnBy: Aidan Gratton; Organization: UW Robotics; Address1: 200 University Avenue; Address2: Waterloo; Address3: Ontario; Address4: Canada N2L 3G6; SheetNumber: 5; SheetTotal: 7
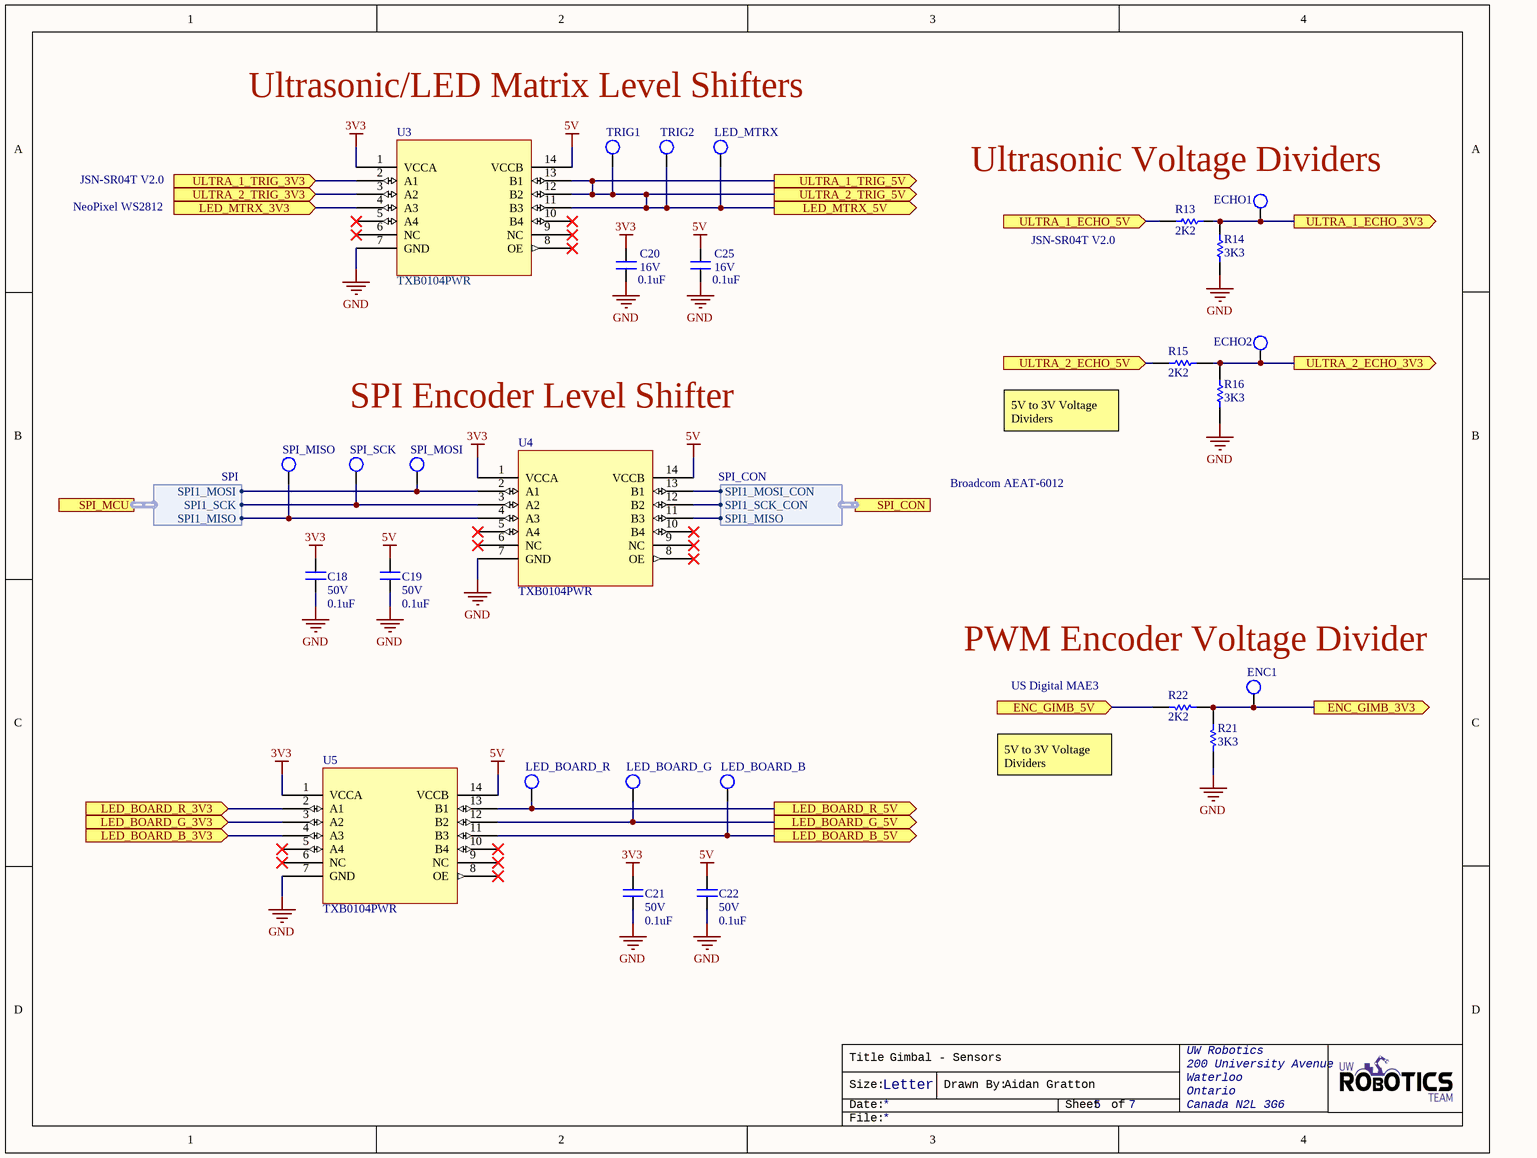
[diagram p4: Sensors.SchDoc]

### Parts
C18  value 0.1uF  Voltage Rating: 50V  [CAPC0603(1608)55_N]  (hidden comment: CAP_0.1uF_50V_0603)
C19  value 0.1uF  Voltage Rating: 50V  [CAPC0603(1608)55_N]  (hidden comment: CAP_0.1uF_50V_0603)
C20  value 0.1uF  Voltage Rating: 16V  [CAPC0603(1608)55_N]  (hidden comment: CAP_0.1uF_16V_0603)
C21  value 0.1uF  Voltage Rating: 50V  [CAPC0603(1608)55_N]  (hidden comment: CAP_0.1uF_50V_0603)
C22  value 0.1uF  Voltage Rating: 50V  [CAPC0603(1608)55_N]  (hidden comment: CAP_0.1uF_50V_0603)
C25  value 0.1uF  Voltage Rating: 16V  [CAPC0603(1608)55_N]  (hidden comment: CAP_0.1uF_16V_0603)
ECHO1  TESTPOINT_LOOP  [TESTPOINT_LOOP]  (value not drawn)
ECHO2  TESTPOINT_LOOP  [TESTPOINT_LOOP]  (value not drawn)
ENC1  TESTPOINT_LOOP  [TESTPOINT_LOOP]  (value not drawn)
LED_BOARD_B  TESTPOINT_LOOP  [TESTPOINT_LOOP]  (value not drawn)
LED_BOARD_G  TESTPOINT_LOOP  [TESTPOINT_LOOP]  (value not drawn)
LED_BOARD_R  TESTPOINT_LOOP  [TESTPOINT_LOOP]  (value not drawn)
LED_MTRX  TESTPOINT_LOOP  [TESTPOINT_LOOP]  (value not drawn)
R13  value 2K2  [RESC0603(1608)_N]  (hidden comment: RES_2K2_0603)
R14  value 3K3  [RESC0603(1608)_N]  (hidden comment: RES_3K3_0603)
R15  value 2K2  [RESC0603(1608)_N]  (hidden comment: RES_2K2_0603)
R16  value 3K3  [RESC0603(1608)_N]  (hidden comment: RES_3K3_0603)
R21  value 3K3  [RESC0603(1608)_N]  (hidden comment: RES_3K3_0603)
R22  value 2K2  [RESC0603(1608)_N]  (hidden comment: RES_2K2_0603)
SPI_MISO  TESTPOINT_LOOP  [TESTPOINT_LOOP]  (value not drawn)
SPI_MOSI  TESTPOINT_LOOP  [TESTPOINT_LOOP]  (value not drawn)
SPI_SCK  TESTPOINT_LOOP  [TESTPOINT_LOOP]  (value not drawn)
TRIG1  TESTPOINT_LOOP  [TESTPOINT_LOOP]  (value not drawn)
TRIG2  TESTPOINT_LOOP  [TESTPOINT_LOOP]  (value not drawn)
U3  TXB0104PWR  [PW14]
U4  TXB0104PWR  [PW14]
U5  TXB0104PWR  [PW14]

### Ports
ENC_GIMB_3V3 (out), ENC_GIMB_5V (in), LED_BOARD_B_3V3 (in), LED_BOARD_B_5V (out), LED_BOARD_G_3V3 (in), LED_BOARD_G_5V (out), LED_BOARD_R_3V3 (in), LED_BOARD_R_5V (out), LED_MTRX_3V3 (in), LED_MTRX_5V (out), SPI_CON (harness SPI_CON), SPI_MCU (harness SPI), ULTRA_1_ECHO_3V3 (out), ULTRA_1_ECHO_5V (in), ULTRA_1_TRIG_3V3 (in), ULTRA_1_TRIG_5V (out), ULTRA_2_ECHO_3V3 (out), ULTRA_2_ECHO_5V (in), ULTRA_2_TRIG_3V3 (in), ULTRA_2_TRIG_5V (out)

### Harnesses
SPI: SPI1_MISO, SPI1_MOSI, SPI1_SCK
SPI_CON: SPI1_MISO, SPI1_MOSI_CON, SPI1_SCK_CON

### Nets
3V3: C18.2 C20.2 C21.2 U3.1(VCCA) U4.1(VCCA) U5.1(VCCA)
5V: C19.2 C22.2 C25.2 U3.14(VCCB) U4.14(VCCB) U5.14(VCCB)
GND: C18.1 C19.1 C20.1 C21.1 C22.1 C25.1 R14.1 R16.2 R21.2 U3.7(GND) U4.7(GND) U5.7(GND)
NetECHO1_1: ECHO1.1 R13.1 R14.2 ; port ULTRA_1_ECHO_3V3
NetECHO2_1: ECHO2.1 R15.1 R16.1 ; port ULTRA_2_ECHO_3V3
NetENC1_1: ENC1.1 R21.1 R22.1 ; port ENC_GIMB_3V3
NetJ4_3: R13.2 ; port ULTRA_1_ECHO_5V
NetJ4_5: LED_MTRX.1 TRIG1.1 TRIG2.1 U3.11(B3) U3.12(B2) U3.13(B1) ; port ULTRA_1_TRIG_5V, port ULTRA_2_TRIG_5V, port LED_MTRX_5V
NetJ4_9: R15.2 ; port ULTRA_2_ECHO_5V
NetJ4_15: U4.13(B1) ; port SPI_CON.SPI1_MOSI_CON
NetJ4_17: U4.12(B2) ; port SPI_CON.SPI1_SCK_CON
NetJ4_19: U4.11(B3) ; port SPI_CON.SPI1_MISO
NetJ4_23: R22.2 ; port ENC_GIMB_5V
NetLED_BOARD_B_1: LED_BOARD_B.1 U5.11(B3) ; port LED_BOARD_B_5V
NetLED_BOARD_G_1: LED_BOARD_G.1 U5.12(B2) ; port LED_BOARD_G_5V
NetLED_BOARD_R_1: LED_BOARD_R.1 U5.13(B1) ; port LED_BOARD_R_5V
NetSPI_MISO_1: SPI_MISO.1 U4.4(A3) ; port SPI_MCU.SPI1_MISO
NetSPI_MOSI_1: SPI_MOSI.1 U4.2(A1) ; port SPI_MCU.SPI1_MOSI
NetSPI_SCK_1: SPI_SCK.1 U4.3(A2) ; port SPI_MCU.SPI1_SCK
NetU3_2: U3.2(A1) ; port ULTRA_1_TRIG_3V3
NetU3_3: U3.3(A2) ; port ULTRA_2_TRIG_3V3
NetU3_4: U3.4(A3) ; port LED_MTRX_3V3
NetU5_2: U5.2(A1) ; port LED_BOARD_R_3V3
NetU5_3: U5.3(A2) ; port LED_BOARD_G_3V3
NetU5_4: U5.4(A3) ; port LED_BOARD_B_3V3

Not connected (* = marked no-connect by the designer): U3 5(A4)* 6(NC)* 8(OE)* 9(NC)* 10(B4)*; U4 5(A4)* 6(NC)* 8(OE)* 9(NC)* 10(B4)*; U5 5(A4)* 6(NC)* 8(OE)* 9(NC)* 10(B4)*

### Notes on the sheet
- Ultrasonic/LED Matrix Level Shifters
- NeoPixel WS2812
- JSN-SR04T V2.0
- Ultrasonic Voltage Dividers
- SPI Encoder Level Shifter
- 5V to 3V Voltage Dividers
- Broadcom AEAT-6012
- PWM Encoder Voltage Divider
- US Digital MAE3
- Title
- Size:
- Date:
- Letter
- Drawn By:
- Sheet
- of
- File:

### Library data of the parts
C18 C19 C21 C22 = CAP_0.1uF_50V_0603: CAP CER 0.1UF 50V X7R 0603; MPN: CC0603KRX7R9BB104; Manufacturer: Yageo; Dimensions: 0.063" L x 0.031" W (1.60mm x 0.80mm); Package: 0603 (1608 Metric); Temperature Coefficient: X7R; Supplier Part Number 1: 311-1344-1-ND; Supplier 1: Digi-Key
C20 C25 = CAP_0.1uF_16V_0603: CAP CER 0.1UF 16V X7R 0603; Manufacturer Part Number 1: CC0603KRX7R7BB104; Manufacturer 1: Yageo; Dimensions: 0.063" L x 0.031" W (1.60mm x 0.80mm); Package: 0603 (1608 Metric); Temperature Coefficient: X7R; Supplier Part Number 1: 311-1088-1-ND; Supplier 1: Digi-Key; Mount: Surface Mount
ECHO1 ECHO2 ENC1 LED_BOARD_B LED_BOARD_G LED_BOARD_R SPI_MISO SPI_MOSI SPI_SCK TRIG1 TRIG2 = TESTPOINT_LOOP: as CR_SERVO on sheet Connectors; Supplier Part Number 1: 36-5002-ND; Supplier 1: Digi-Key
LED_MTRX = TESTPOINT_LOOP: Loop testpoint through-hole pad; Manufacturer 1: Keystone Electronics; Manufacturer Part Number 1: 5002; Supplier Part Number 1: 36-5002-ND; Supplier 1: Digi-Key; Mount: Through Hole
R13 R15 R22 = RES_2K2_0603: RES SMD 2.2K OHM 1% 1/10W 0603; Manufacturer: Yageo; MPN: RC0603FR-072K2L; Dimensions: 0.063" L x 0.031" W (1.60mm x 0.80mm); Package: 0603 (1608 Metric); Tolerance: 1%; Supplier Part Number 1: 311-2.20KHRCT-ND; Supplier 1: Digi-Key
R14 = RES_3K3_0603: RES SMD 3.3K OHM 5% 1/10W 0603; Manufacturer 1: Yageo; Manufacturer Part Number 1: RC0603JR-073K3L; Dimensions: 0.063" L x 0.031" W (1.60mm x 0.80mm); Package: 0603 (1608 Metric); Tolerance: 5%; Digikey Part Number: 311-3.3KGRCT-ND; Supplier 1: Digi-Key; Supplier Part Number 1: 311-3.3KGRCT-ND; Mount: Surface Mount
R16 R21 = RES_3K3_0603: RES SMD 3.3K OHM 5% 1/10W 0603; Manufacturer: Yageo; MPN: RC0603JR-073K3L; Dimensions: 0.063" L x 0.031" W (1.60mm x 0.80mm); Package: 0603 (1608 Metric); Tolerance: 5%; Digikey Part Number: 311-3.3KGRCT-ND; Supplier 1: Digi-Key; Supplier Part Number 1: 311-3.3KGRCT-ND
U3-U5 = IC_4CH_LVL_SHIFTER: 4-Bit Bidirectional Voltage-Level Translator with Auto Direction Sensing / VCCA < VCCB, see datasheet; Vendor: Texas Instruments; PACKAGE_DESIGNATOR: PW; PIN_COUNT: 14; FAMILY_NAME: AUTO DIRECTION SENSING DUAL SUPPLY TRANSLATOR; INDUSTRY_STD_PKG_TYPE: TSSOP; Manufacturer_Part_Number: TXB0104PWR; GENERIC_PART_NUMBER: TXB0104; Datasheet_URL: http://www.ti.com/lit/gpn/TXB0104; Manufacturer: Texas Instruments; Supplier 1: Digi-Key; Supplier Part Number 1: 296-21929-1-ND